# EAGLE design open-lab-VUSB-C (EAGLE 6.5.0)
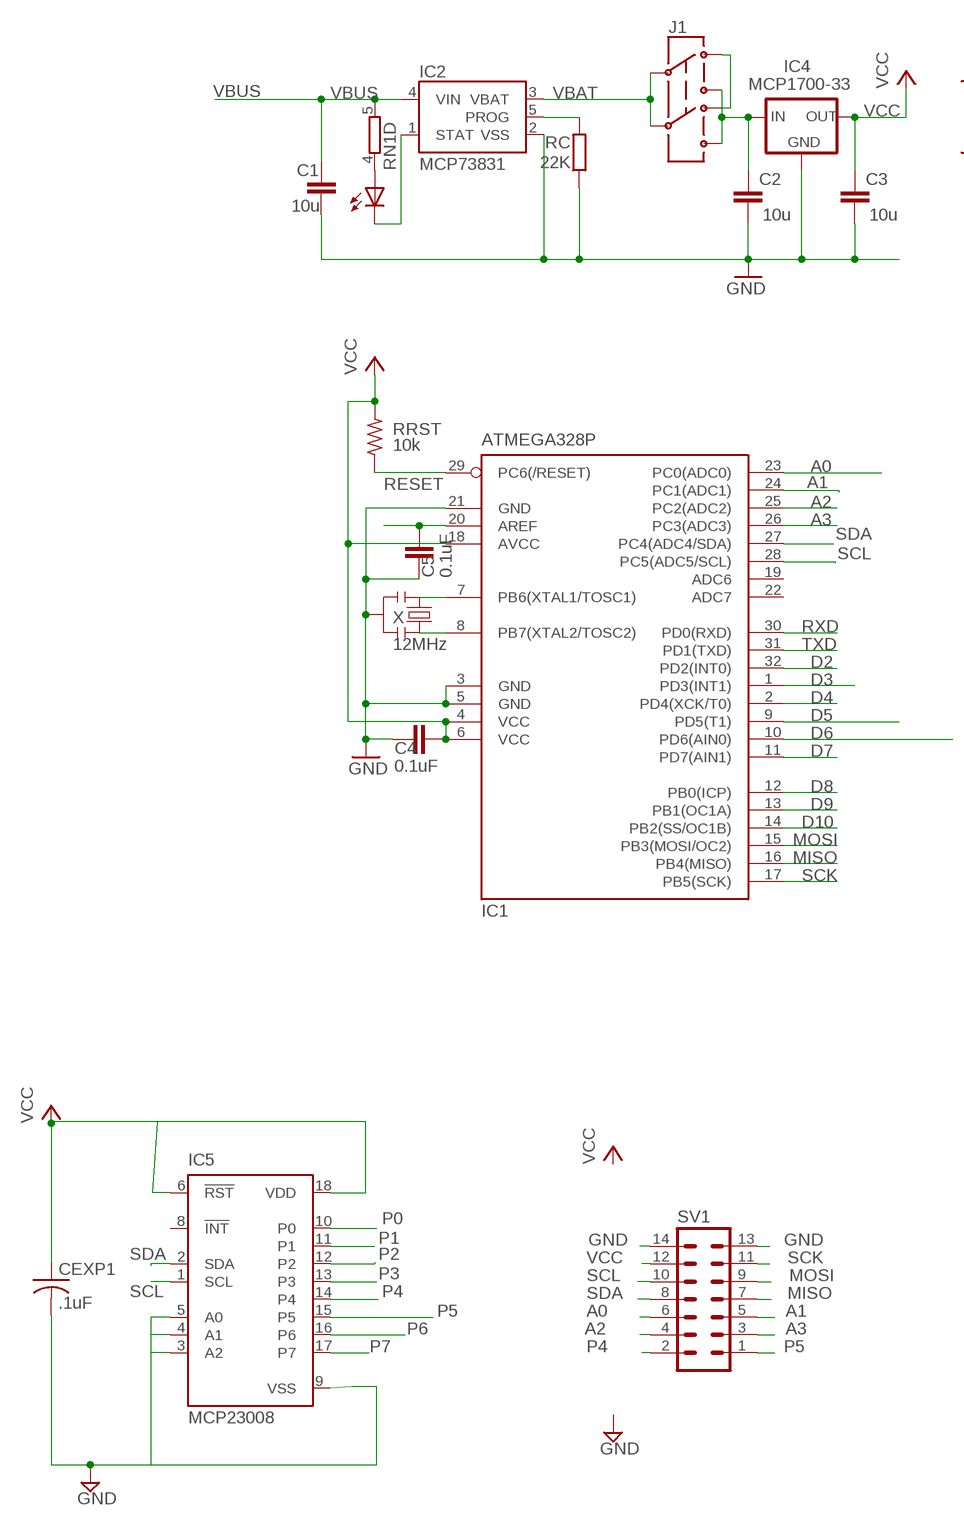
[diagram p0: schematic, sheet 1, part 1 of 2]
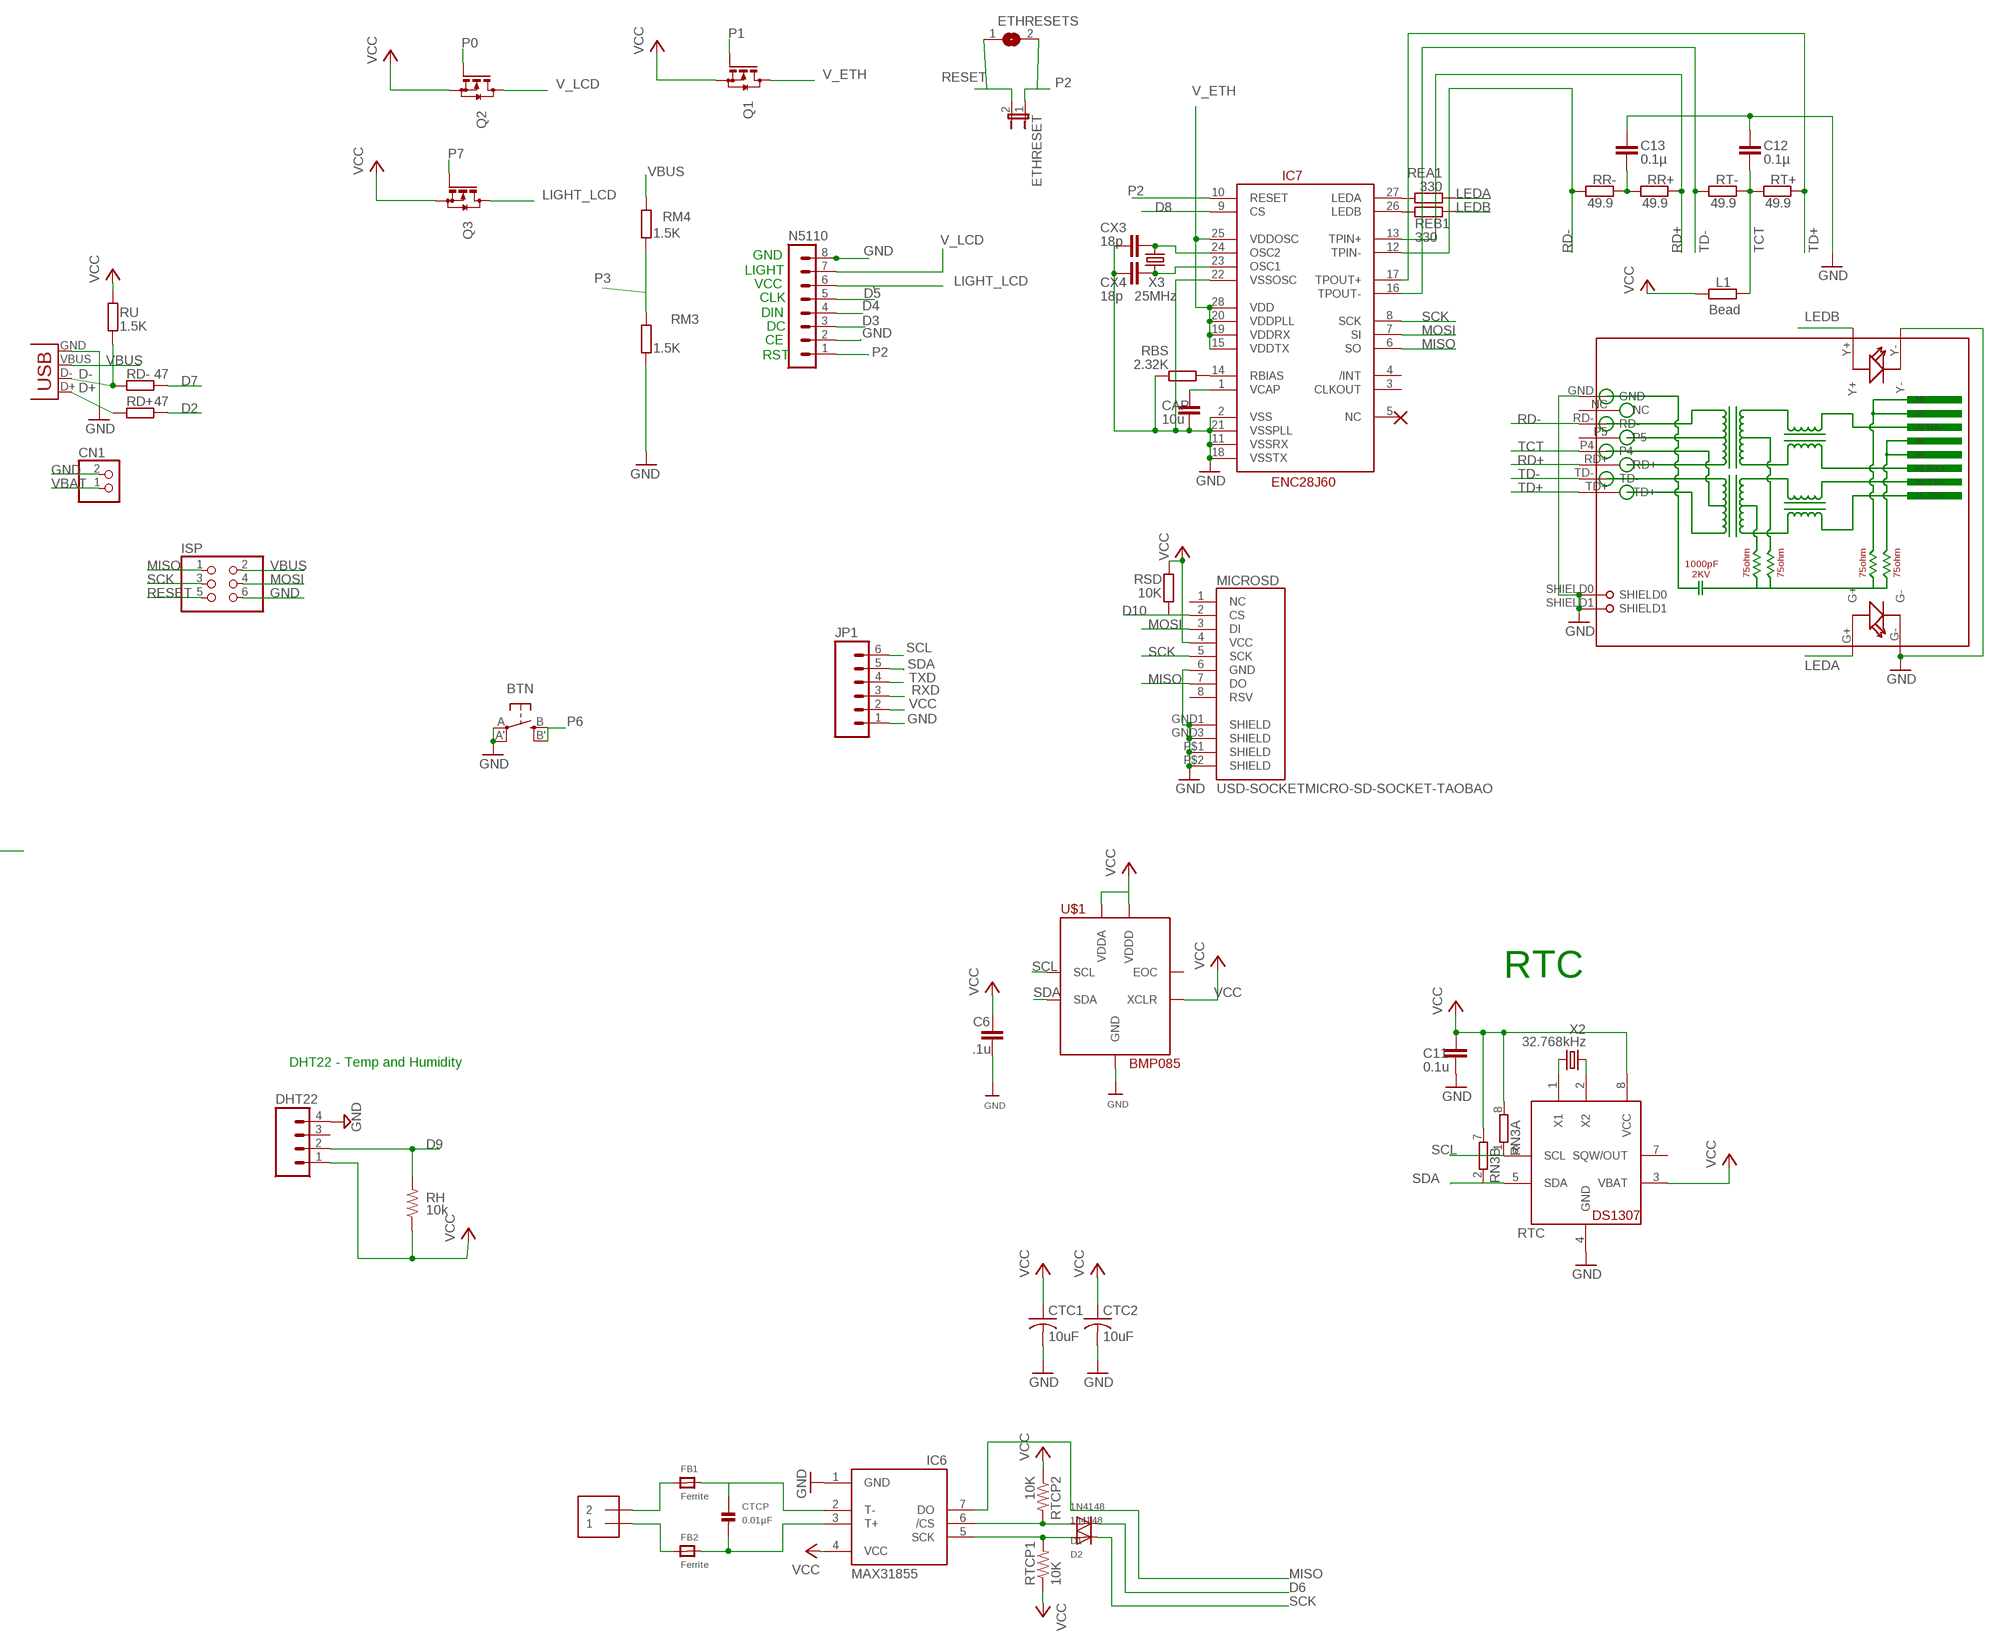
[diagram p1: schematic, sheet 1, part 2 of 2]

## Parts
BTN  EVQQ2  [EVQ-Q2]
C1  10u  C-EUC0805  [C0805]
C2  10u  C-EUC0805  [C0805]
C3  10u  C-EUC0805  [C0805]
C4  0.1uF  C-EUC0805  [C0805]
C5  0.1uF  C-EUC0805  [C0805]
C6  .1u  C-EUC0805  [C0805]
C11  0.1u  C-EUC0805  [C0805]
C12  0.1µ  C-EUC0805  [C0805]
C13  0.1µ  C-EUC0805  [C0805]
CAP  10u  C-EUC0805  [C0805]
CEXP1  .1uF  C-USC0805K  [C0805K]
CHG  0805  LEDCHIPLED_0805  [CHIPLED_0805]
CN1  JST_2PIN-SMT-RA  [JST-PH-2-SMT-RA]
CTC1  10uF  C-USC0805K  [C0805K]
CTC2  10uF  C-USC0805K  [C0805K]
CTCP  0.01µF  CAP_CERAMIC_0805  [_0805]
CX3  18p  C-EUC0805  [C0805]
CX4  18p  C-EUC0805  [C0805]
D1  1N4148  DIODESOD-323F  [SOD-323F]
D2  1n4148  DIODESOD-323F  [SOD-323F]
DHT22  M04LOCK  [1X04_LOCK]
ETHRESET  JP1E  [JP1]
ETHRESETS  SJ  [SJ]
FB1  Ferrite  FERRITE_0805  [_0805]
FB2  Ferrite  FERRITE_0805  [_0805]
IC1  ATMEGA328P  MEGA8-AI  [TQFP32-08]
IC2  MCP73831  [SOT23-5]
IC4  MCP1700-33  MCP1700SOT233  [SOT23]
IC5  MCP23008  MCP23008T  [SO18W]
IC6  MAX31855  MAX6675  [SO08]
IC7  ENC28J60  ENC28J60SO28LONG  [SOIC28WLONG]
ISP  PINHD-2X3  [2X03]
J1  AYZ0202  [AYZ0202]
JP1  M06LOCK  [1X06_LOCK]
L1  Bead  R-EU_R0805  [R0805]
MICROSD  USD-SOCKETMICRO-SD-SOCKET-TAOBAO  [MICRO-SD-SOCKET-TAOBAO]
N5110  MA08-1  [MA08-1]
Q1  BSS123  [SOT23]
Q2  BSS123  [SOT23]
Q3  BSS123  [SOT23]
RBS  2.32K  R-EU_R0805  [R0805]
RC  22K  R-EU_R0805  [R0805]
RD+  47  R-EU_R0805  [R0805]
RD-  47  R-EU_R0805  [R0805]
REA1  330  R-EU_R0805  [R0805]
REB1  330  R-EU_R0805  [R0805]
RH  10k  R-US_R0805  [R0805@1]
RJ45  HR911105A  [HR911105A]
RM3  1.5K  R-EU_R0805  [R0805]
RM4  1.5K  R-EU_R0805  [R0805]
RN1  4R-NEXB38V  [EXB38V]
RN3  4R-NEXB38V  [EXB38V]
RR+  49.9  R-EU_R0805  [R0805]
RR-  49.9  R-EU_R0805  [R0805]
RRST  10k  R-US_R0805  [R0805@1]
RSD  10K  R-EU_R0805  [R0805]
RT+  49.9  R-EU_R0805  [R0805]
RT-  49.9  R-EU_R0805  [R0805]
RTC  DS1307  DS1307SOIC  [SO08]
RTCP1  10K  R-US_R0805  [R0805]
RTCP2  10K  R-US_R0805  [R0805]
RU  1.5K  R-EU_R0805  [R0805]
SV1  MA07-2  [MA07-2]
TCPL  1X2-3.5MM  [1X2-3.5MM]
U$1  BMP085  [BMP085]
X  12MHz  RESONATORSMD  [RESONATOR-SMD]
X1  USBSMD  [USB-MINIB]
X2  32.768kHz  CRYSTALTC26H  [TC26H]
X3  25MHz  CRYSTALHC49UV  [HC49U-V]

## Nets
A0: IC1.23(PC0(ADC0)) SV1.6
A1: IC1.24(PC1(ADC1)) SV1.5
A2: IC1.25(PC2(ADC2)) SV1.4
A3: IC1.26(PC3(ADC3)) SV1.3
AREF: C5.2 IC1.20(AREF)
CS: D1.A IC6.6(/CS) RTCP2.2
D2: IC1.32(PD2(INT0)) RD+.2
D3: IC1.1(PD3(INT1)) N5110.3
D4: IC1.2(PD4(XCK/T0)) N5110.4
D5: IC1.9(PD5(T1)) N5110.5
D6: D1.C IC1.10(PD6(AIN0))
D7: IC1.11(PD7(AIN1)) RD-.2
D8: IC1.12(PB0(ICP)) IC7.9(CS)
D9: DHT22.2 IC1.13(PB1(OC1A)) RH.2
D10: IC1.14(PB2(SS/OC1B)) MICROSD.2(CS) RSD.1
D+: RD+.1 X1.D+
D-: RD-.1 RU.1 X1.D-
GND: BTN.A'(P1) BTN.A(P) C1.2 C2.2 C3.2 C4.1 C5.1 C6.2 C11.2 C12.1 C13.1 CAP.2 CEXP1.2 CN1.2 CTC1.2 CTC2.2 CX3.2 CX4.2 DHT22.4 IC1.3(GND) IC1.5(GND) IC1.21(GND) IC2.2(VSS) IC4.1(GND) IC5.3(A2) IC5.4(A1) IC5.5(A0) IC5.9(VSS) IC6.1(GND) IC7.2(VSS) IC7.11(VSSRX) IC7.18(VSSTX) IC7.21(VSSPLL) IC7.22(VSSOSC) ISP.6 JP1.1 MICROSD.6(GND) MICROSD.GND1(SHIELD) MICROSD.GND3(SHIELD) MICROSD.P$1(SHIELD) MICROSD.P$2(SHIELD) N5110.2 N5110.8 RBS.1 RC.1 RJ45.G- RJ45.GND RJ45.SHIELD0 RJ45.SHIELD1 RJ45.Y- RM3.1 RTC.4(GND) SV1.13 SV1.14 U$1.P$1(GND) X1.GND X.2
LEDA: REA1.2 RJ45.G+
LEDB: REB1.2 RJ45.Y+
LIGHT_LCD: N5110.6 Q3.3(D)
MISO: IC1.16(PB4(MISO)) IC6.7(DO) IC7.6(SO) ISP.1 MICROSD.7(DO) SV1.7
MOSI: IC1.15(PB3(MOSI/OC2)) IC7.7(SI) ISP.4 MICROSD.3(DI) SV1.9
N$1: J1.3 J1.6
N$2: IC1.7(PB6(XTAL1/TOSC1)) X.1
N$3: IC1.8(PB7(XTAL2/TOSC2)) X.3
N$5: CHG.C IC2.1(STAT)
N$6: IC2.5(PROG) RC.2
N$8: FB1.1 TCPL.2
N$9: CTCP.1 FB1.2 IC6.2(T-)
N$10: CHG.A RN1.4
N$11: FB2.1 TCPL.1
N$12: CTCP.2 FB2.2 IC6.3(T+)
N$21: RTC.1(X1) X2.2
N$30: RTC.2(X2) X2.1
N$34: IC7.27(LEDA) REA1.1
N$37: IC7.26(LEDB) REB1.1
N$39: CAP.1 IC7.1(VCAP)
N$41: CX3.1 IC7.24(OSC2) X3.2
N$42: CX4.1 IC7.23(OSC1) X3.1
N$54: C13.2 RR+.2 RR-.1
N$59: IC7.14(RBIAS) RBS.2
P0: IC5.10(P0) Q2.1(G)
P1: IC5.11(P1) Q1.1(G)
P2: ETHRESET.1 ETHRESETS.2 IC5.12(P2) IC7.10(RESET) N5110.1
P3: IC5.13(P3) RM3.2 RM4.1
P4: IC5.14(P4) SV1.2
P5: IC5.15(P5) SV1.1
P6: BTN.B'(S1) BTN.B(S) IC5.16(P6)
P7: IC5.17(P7) Q3.1(G)
RD+: IC7.13(TPIN+) RJ45.RD+ RR+.1
RD-: IC7.12(TPIN-) RJ45.RD- RR-.2
RESET: ETHRESET.2 ETHRESETS.1 IC1.29(PC6(/RESET)) ISP.5 RRST.1
RXD: IC1.30(PD0(RXD)) JP1.3
SCK: D2.C IC1.17(PB5(SCK)) IC7.8(SCK) ISP.3 MICROSD.5(SCK) SV1.11
SCK1: D2.A IC6.5(SCK) RTCP1.2
SCL: IC1.28(PC5(ADC5/SCL)) IC5.1(SCL) JP1.6 RN3.1 RTC.6(SCL) SV1.10 U$1.P$6(SCL)
SDA: IC1.27(PC4(ADC4/SDA)) IC5.2(SDA) JP1.5 RN3.2 RTC.5(SDA) SV1.8 U$1.P$7(SDA)
TCT: C12.2 L1.1 RJ45.P4 RT+.2 RT-.1
TD+: IC7.17(TPOUT+) RJ45.TD+ RT+.1
TD-: IC7.16(TPOUT-) RJ45.TD- RT-.2
TXD: IC1.31(PD1(TXD)) JP1.4
V_ETH: IC7.15(VDDTX) IC7.19(VDDRX) IC7.20(VDDPLL) IC7.25(VDDOSC) IC7.28(VDD) Q1.3(D)
V_LCD: N5110.7 Q2.3(D)
VBAT: CN1.1 IC2.3(VBAT) J1.2 J1.5
VBUS: C1.1 IC2.4(VIN) ISP.2 RM4.2 RN1.5 X1.VBUS
VCC: C3.1 C4.2 C6.1 C11.1 CEXP1.1 CTC1.1 CTC2.1 DHT22.1 IC1.4(VCC) IC1.6(VCC) IC1.18(AVCC) IC4.2(OUT) IC5.6(!RST) IC5.18(VDD) IC6.4(VCC) JP1.2 L1.2 MICROSD.4(VCC) Q1.2(S) Q2.2(S) Q3.2(S) RH.1 RN3.7 RN3.8 RRST.2 RSD.2 RTC.3(VBAT) RTC.8(VCC) RTCP1.1 RTCP2.1 RU.2 SV1.12 U$1.P$3(VDDA) U$1.P$4(VDDD) U$1.P$8(XCLR)
VDD: C2.1 IC4.3(IN) J1.1 J1.4
Unconnected: DHT22.3 IC1.19(ADC6) IC1.22(ADC7) IC5.8(!INT) IC7.3(CLKOUT) IC7.4(/INT) IC7.5(NC) MICROSD.1(NC) MICROSD.8(RSV) RJ45.NC RJ45.P5 RN1.1 RN1.2 RN1.3 RN1.6 RN1.7 RN1.8 RN3.3 RN3.4 RN3.5 RN3.6 RTC.7(SQW/OUT) U$1.P$2(EOC)

## Notes on the sheet
- GND
- LIGHT
- VCC
- CLK
- DIN
- DC
- CE
- RST
- RTC
- DHT22 - Temp and Humidity

## Library data of the parts
BTN = adafruit:EVQQ2: SMT 6mm switch, EVQQ2 series http://www.ladyada.net/library/eagle
C1-C3 C6 C12 C13 CAP CX3 CX4 = resistor:C-EU: CAPACITOR, European symbol
C4 C5 C11 = rcl:C-EU: CAPACITOR, European symbol
CEXP1 CTC1 CTC2 = adafruit:C-US: CAPACITOR, American symbol
CHG = led:LED: LED OSRAM: - CHIPLED LG R971, LG N971, LY N971, LG Q971, LY Q971, LO R971, LY R971 LH N974, LH R974 LS Q976, LO Q976, LY Q976 LO Q996 - Hyper CHIPLED LW Q18S LB Q993, LB Q99A, LB R99A - SideLED LS A670, LO A670, LY A670, LG A670, LP A670 LB A673, LV A673, LT A673, LW A673 LH A674 LY A675 LS A676, LA A676, LO A676, LY A676, LW A676 LS A679, LY A679, LG A679 - Hyper Micro SIDELED® LS Y876, LA Y876, LO Y876, LY Y876 LT Y87S - SmartLED LW L88C, LW L88S LB L89C, LB L89S, LG L890 LS L89K, LO L89K, LY L89K LS L896, LA L896, LO L896, LY L896 - TOPLED LS T670, LO T670, LY T670, LG T670, LP T670 LSG T670, LSP T670, LSY T670, LOP T670, LYG T670 LG T671, LOG T671, LSG T671 LB T673, LV T673, LT T673, LW T673 LH T674 LS T676, LA T676, LO T676, LY T676, LB T676, LH T676, LSB T676, LW T676 LB T67C, LV T67C, LT T67C, LS T67K, LO T67K, LY T67K, LW E67C LS E67B, LA E67B, LO E67B, LY E67B, LB E67C, LV E67C, LT E67C LW T67C LS T679, LY T679, LG T679 LS T770, LO T770, LY T770, LG T770, LP T770 LB T773, LV T773, LT T773, LW T773 LH T774 LS E675, LA E675, LY E675, LS T675 LS T776, LA T776, LO T776, LY T776, LB T776 LHGB T686 LT T68C, LB T68C - Hyper Mini TOPLED® LB M676 - Mini TOPLED Santana® LG M470 LS M47K, LO M47K, LY M47K Source: http://www.osram.convergy.de LUXEON: - LUMILED® LXK2-PW12-R00, LXK2-PW12-S00, LXK2-PW14-U00, LXK2-PW14-V00 LXK2-PM12-R00, LXK2-PM12-S00, LXK2-PM14-U00 LXK2-PE12-Q00, LXK2-PE12-R00, LXK2-PE12-S00, LXK2-PE14-T00, LXK2-PE14-U00 LXK2-PB12-K00, LXK2-PB12-L00, LXK2-PB12-M00, LXK2-PB14-N00, LXK2-PB14-P00, LXK2-PB14-Q00 LXK2-PR12-L00, LXK2-PR12-M00, LXK2-PR14-Q00, LXK2-PR14-R00 LXK2-PD12-Q00, LXK2-PD12-R00, LXK2-PD12-S00 LXK2-PH12-R00, LXK2-PH12-S00 LXK2-PL12-P00, LXK2-PL12-Q00, LXK2-PL12-R00 Source: www.luxeon.com KINGBRIGHT: KA-3528ASYC Source: www.kingbright.com
CN1 = adafruit:JST_2PIN: JST 2-Pin Connectors of various flavors SMT-RA (S2B-PH-SM4) 4UConnector #17311 SMT (B2B-PH-SM4) THM-RA (S2B-PH) THM (B2B-PH)
CTCP = microbuilder:CAP_CERAMIC: Ceramic Capacitors 0402 - 0402 Surface Mount Capacitors 16pF 50V 5% [Digikey: 445-4899-2-ND] 18pF 50V 5% [Digikey: 490-1281-2-ND] 22pF 50V 5% [Digikey: 490-1283-2-ND] 68pF 50V 5% [Digikey: 490-1289-2-ND] 0.1uF 10V 10% [Digikey: 490-1318-2-ND] 1.0uF 6.3V 10% [Digikey: 490-1320-2-ND] 0603 - 0603 Surface Mount Capacitors 16 pF 50V 5% [Digikey: 445-5051-2-ND] 22 pF 50V [Digikey: PCC220ACVTR-ND] 33 pF 50V 5% [Digikey: 490-1415-1-ND] 56pF 50V 5% [Digikey: 490-1421-1-ND] 220pF 50V 5% [Digikey: 445-1285-1-ND] 680 pF 50V 2200 pF 50V 5% C0G [Digikey: 445-1297-1-ND] 5600 pF 100V 5% X7R [Digikey: 478-3711-1-ND] 0.1 µF 25V 10% [Digikey: PCC2277TR-ND] 0.22 µF 16V 10% X7R [Digikey: 445-1318-1-ND] 1.0 µF 25V 10% [Digikey: 445-5146-2-ND] 0603 - RF Specific 3pF 250V +/-0.1pF RF [Digikey: 712-1347-1-ND] 18 pF 250V 5% [Digikey: 478-3505-1-ND or 712-1322-1-ND] 56 pF 250V 5% C0G RF [Digikey: 490-4867-1-ND] 68 pF 250V RF [Digikey: 490-4868-1-ND] 0805 - 0805 Surface Mount Capacitors 220 pF 250V 2% RF Ceramic Capacitor [Digikey: 712-1398-1-ND] 1000 pF 50V 2% NP0 Ceramic Capacitor [Digikey: 478-3760-1-ND] 0.1 µF 25V 10% Ceramic Capacitor [Digikey: PCC1828TR-ND] 1.0 µF 16V 10% Ceramic Capacitor[Digikey: 490-1691-2-ND] 10.0 µF 10V 10% Ceramic Capacitor[Digikey: 709-1228-1-ND] 10.0 uF 16V 10% Ceramic Capacitor [Digikey: 478-5165-2-ND] 47 uF 6.3V 20% Ceramic Capacitor [Digikey: 587-1779-1-ND or 399-5506-1-ND] 1206 - 1206 Surface Mount Capacitors 47uF 10V 20% Ceramic Capacitor [Digikey: 490-5528-1-ND or 399-5508-1-ND or 445-6010-1-ND] 100uF 6.3V -20%, +80% Y5V Ceramic Capacitor (Digikey: 490-4512-1-ND, Mouser: 81-GRM31CF50J107ZE1L)
D1 D2 = adafruit:DIODE: Diode SMADIODE - SMA Surface Mount Package 20V 1A Schottky Diode Digikey: 641-1014-6-ND DO-1N4148 - Through Hole Small Current Diode SOD-123 20V 1 A (.5mV Vf) Schottky Diode - Digikey: MBRX120TPMSCT-ND SOD-323 10V 570mA (.38mV Vf, 3ns) Schottky Diode - Digikey: ZLLS410CT-ND SOD-523 30V 30mA Schottky Diode (RB751S-40TE61) - Digikey: RB751S-40TE61CT-ND SOT23-R/W - SOT23 Package (R = Solder Paste/Reflow Ovens, W = Hand-Soldering) BAT54Film 40V 300mA - Digikey: 497-7162-1-ND
DHT22 = SparkFun-Connectors:M04: Header 4 Standard 4-pin 0.1" header. Use with straight break away headers (SKU : PRT-00116), right angle break away headers (PRT-00553), swiss pins (PRT-00743), machine pins (PRT-00117), and female headers (PRT-00115). Molex polarized connector foot print use with SKU : PRT-08231 with associated crimp pins and housings. 1MM SMD Version SKU: PRT-10208
ETHRESET = jumper:JP1E: JUMPER
ETHRESETS = jumper:SJ: SMD solder JUMPER
FB1 FB2 = microbuilder:FERRITE: Ferrite Bead 0603 MMZ1608B121C - 120 Ohm @ 100MHz, 600mA, 0.15 Ohm DC Resistance - Digikey: 445-2164-1-ND BK1608HW121-T - 120 Ohm, 600mA Ferrite Chip - Digikey: 587-1876-2-ND 0805 HZ0805B272R-10 - 2.7K Ohm @ 100MHz, 200mA, 0.8 Ohm DC Resistance - Digikey: 240-2504-1-ND (see also Murata BLM21BD272SN1L) MMZ2012Y152B - 1.5K Ohm @ 100MHz, 500mA, 0.4 Ohm DC Resistance - Digikey: 445-1560-1-ND - Mainly for high frequency (80-400MHz) MMZ2012R102A - 1K Ohm @ 100MHz, 500mA, 0.3 Ohm DC Resistance - Digikey: 445-1555-2-ND - More general purpose (10-200MHz)
IC1 = atmel:MEGA8: MICROCONTROLLER 8 Kbytes FLASH, 1 kbytes SRAM, 512 bytes EEPROM, USART, 6-channel 10 bit ADC, 2-channel 8 bit ADC Pin compatible with Atmega48, ATMega88, ATMega168 Source: avr.lbr; MPN: ATMEGA8-16AU; OC_FARNELL: 9171371; OC_NEWARK: 73M8863
IC2 = SparkFunNew:MCP73831: Microchip's MCP73831 Miniature single cell, fully integrated Li-Ion, Li-polymer charge management controller http://ww1.microchip.com/downloads/en/DeviceDoc/21984a.pdf
IC4 = adafruit:MCP1700: VOLTAGE REGULATOR
IC5 = JeeLabs:MCP23008: I2C-Bus Remote 8-bit I/O expander http://www.semiconductors.philips.com/acrobat_download/datasheets/PCF8574_4.pdf
IC6 = adafruit:MAX6675
IC7 = SparkFun:ENC28J60
ISP = pinhead:PINHD-2X3: PIN HEADER
J1 = SparkFunNew:AYZ0202: SPDT Slide Switch Simple SMD single-pull double-throw slide switch. Good for less than 350mA power switch, switching UARTs between devices, etc. Spark Fun Electronics SKU : COM-00597
JP1 = SparkFun-Connectors:M06: Header 6 Standard 6-pin 0.1" header. Use with straight break away headers (SKU : PRT-00116), right angle break away headers (PRT-00553), swiss pins (PRT-00743), machine pins (PRT-00117), and female headers (PRT-00115). Molex polarized connector foot print use with SKU : PRT-08094 with associated crimp pins and housings. NOTES ON THE VARIANTS LOCK and LOCK_LONGPADS... This footprint was designed to help hold the alignment of a through-hole component (i.e. 6-pin header) while soldering it into place. You may notice that each hole has been shifted either up or down by 0.005 of an inch from it's more standard position (which is a perfectly straight line). This slight alteration caused the pins (the squares in the middle) to touch the edges of the holes. Because they are alternating, it causes a "brace" to hold the component in place. 0.005 has proven to be the perfect amount of "off-center" position when using our standard breakaway headers. Although looks a little odd when you look at the bare footprint, once you have a header in there, the alteration is very hard to notice. Also,if you push a header all the way into place, it is covered up entirely on the bottom side. This idea of altering the position of holes to aid alignment will be further integrated into the Sparkfun Library for other footprints. It can help hold any component with 3 or more connection pins.
L1 RBS RC RD+ RD- REA1 REB1 RM3 RM4 RR+ RR- RSD RT+ RT- RU = rcl:R-EU_: RESISTOR, European symbol
MICROSD = SparkFunNew:USD-SOCKET: microSD Socket Push-push type uSD socket. Schematic element and footprint production proven. Spark Fun Electronics SKU : PRT-00127. tDoc lines correctly indicate media card edge positions when inserting (unlocked, locked, depressed).
N5110 = con-lstb:MA08-1: PIN HEADER; OC_FARNELL: unknown; OC_NEWARK: unknown
Q1-Q3 = transistor-small-signal:BSS123: N-CHANNEL MOS FET
RH RRST = rcl:R-US_: RESISTOR, American symbol
RJ45 = CONNECTER:HR911105A
RN1 RN3 = resistor-dil:4R-N: Array Chip Resistor Source: RS Component / Phycomp; OC_FARNELL: unknown; OC_NEWARK: unknown
RTC = adafruit:DS1307: DS1307 Real time clock (RTC) with battery backup ability. Talk to it via i2c
RTCP1 RTCP2 = adafruit:R-US_: RESISTOR, American symbol
SV1 = con-lstb:MA07-2: PIN HEADER; OC_FARNELL: unknown; OC_NEWARK: unknown
TCPL = adafruit:1X2: 3.5mm Terminal block http://www.ladyada.net/library/pcb/eaglelibrary.html
U$1 = JeeLabs:BMP085: BMP086 Bosch Digital Pressure Sensor
X = SparkFunNew:RESONATOR: Resonator Small SMD resonator. This is the itty bitty 10/20MHz resonators with built in caps. CSTCE10M0G55 and CSTCE20M0V53. Footprint has been reviewed closely but hasn't been tested yet.
X1 = SparkFun:USB: USB Connectors USB-B-PTH is fully proven SKU : PRT-00139 USB-miniB is fully proven SKU : PRT-00587 USB-A-PCB is untested. USB-A-H is throughly reviewed, but untested. Spark Fun Electronics SKU : PRT-00437 USB-B-SMT is throughly reviewed, but untested. Needs silkscreen touching up. USB-A-S has not been used/tested USB-MB-H has not been used/tested
X2 = crystal:CRYSTAL: CRYSTAL; OC_FARNELL: unknown; OC_NEWARK: unknown
X3 = SparkFun:CRYSTAL: Crystals Various standard crystals. Proven footprints. Spark Fun Electronics SKU : COM-00534

## Net classes
0 default: width 0.203 mm
1 power: width 0.381 mm

## Board
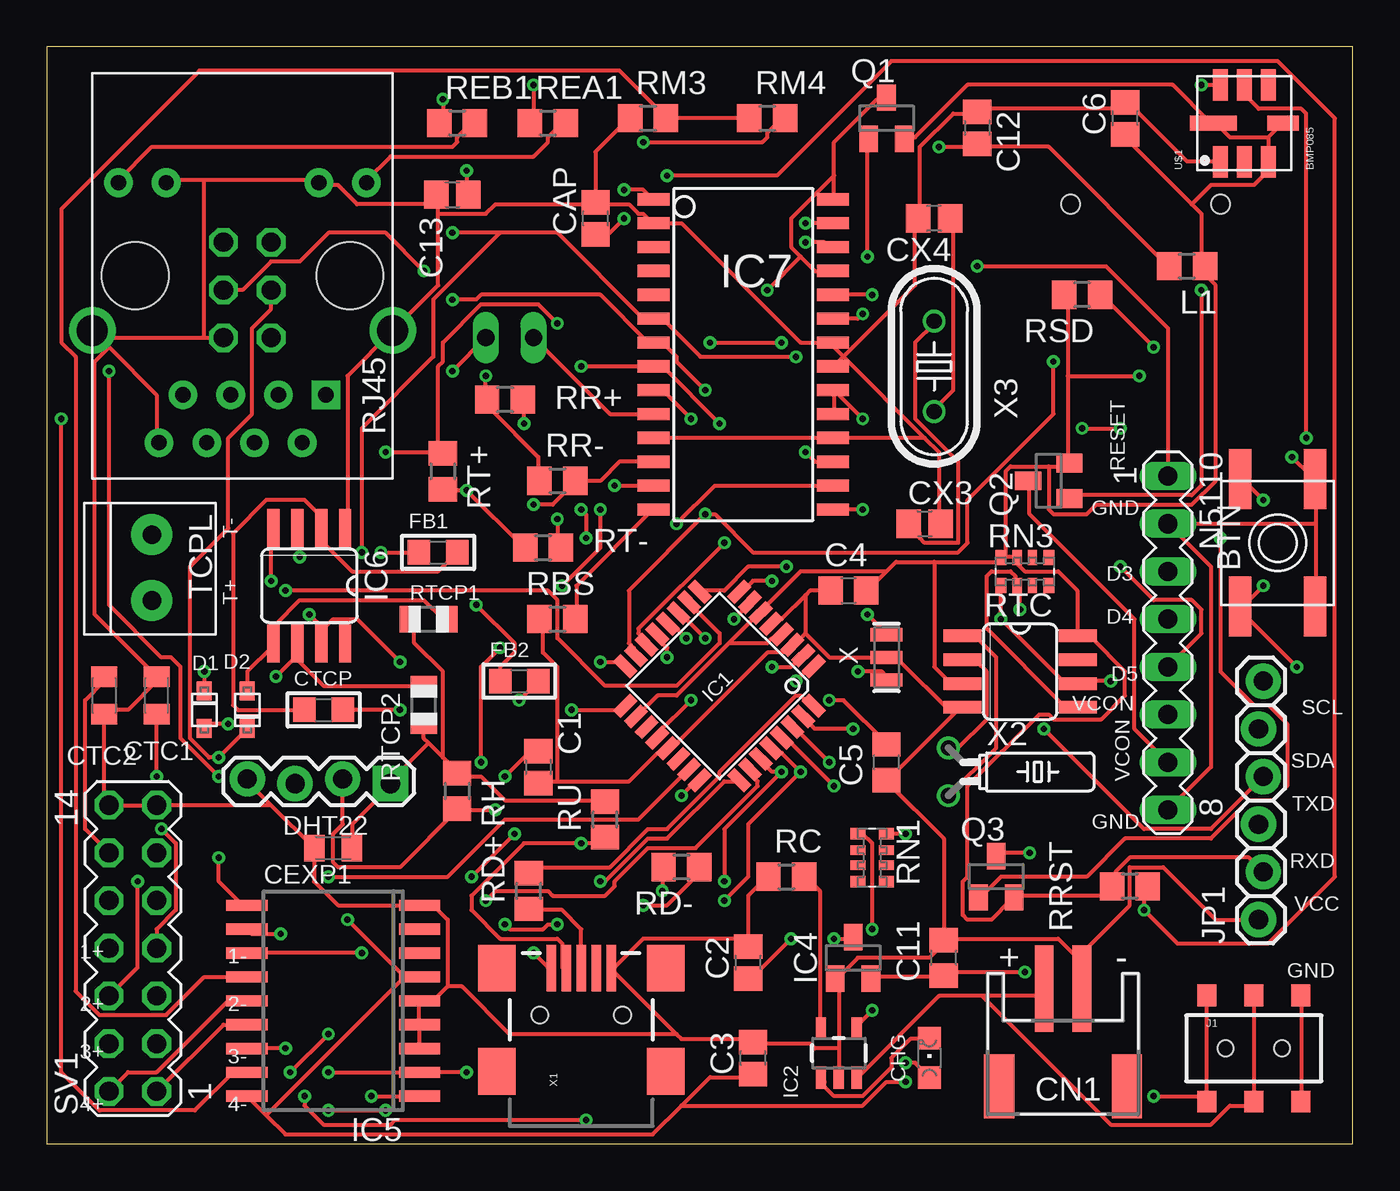
[diagram p2: board, top side]
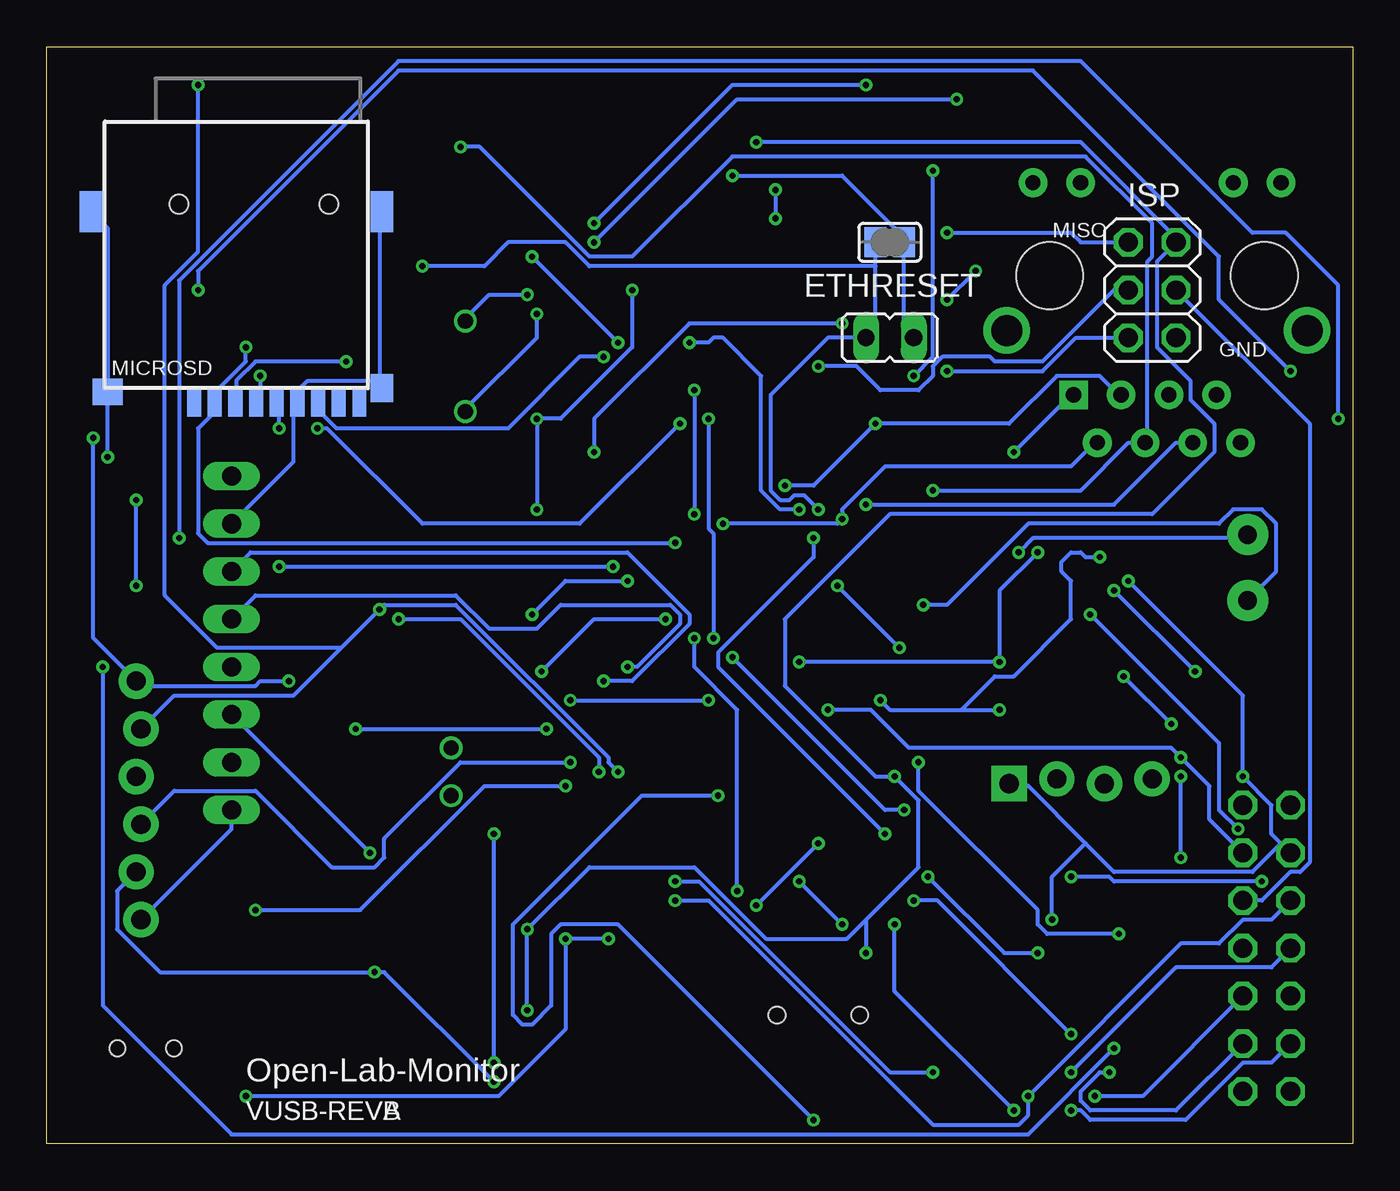
[diagram p3: board, bottom side, seen from below]

Size 69.52 x 58.41 mm. Coordinates in mm from the lower left corner, seen from the top.
Outline: 0,0 69.52,0 69.52,58.41 0,58.41 0,0
Copper layers (1*16): Top 0.0356mm / dielectric 1.5011mm / Bottom 0.0356mm
Design rules "LaenPCBOrder": minimum track width 6mil, minimum drill 13mil, track to track 6mil, track to pad 6mil, pad to pad 6mil, via to via 6mil, smd to smd 6mil, copper to edge 15mil, drill to drill 6mil, minimum pad ring 7mil, minimum via ring 7mil, stop-mask expansion 3mil, vias tented up to drill 0mil, thermal gap 10mil

### Footprints (pad centres in the part's own frame; a part is rotated, then mirrored left to right if it is on the bottom)
EVQ-Q2 = smd 3.2 x 1.2: A -3.4,-2; A' 3.4,-2; B -3.4,2; B' 3.4,2
C0805 = smd 1.3 x 1.5: 1 -0.85,0; 2 0.85,0
C0805' = smd 1.3 x 1.5: 1 -0.95,0; 2 0.95,0
C0805K = smd 1.1 x 1.4: 1 -1,0; 2 1,0
CHIPLED_0805 = smd 1.2 x 1.2: A 0,-1.05; C 0,1.05
JST-PH-2-SMT-RA = smd 1 x 4.6: 1 1,-3.7; 2 -1,-3.7 | smd 1.6 x 3.4: NC1 -3.4,1.5; NC2 3.4,1.5
_0805 = smd 1.2 x 1.3: 1 -1.016,0; 2 1.016,0
SOD-323F = smd 1 x 0.8: A -1,0; C 1,0
1X04_LOCK = drill 1.016 pad 1.88 square: 1 0,0.127 | drill 1.016 pad 1.88: 2 2.54,-0.127; 3 5.08,0.127; 4 7.62,-0.127
JP1 = drill 0.914 long: 1 0,-1.27; 2 0,1.27
SJ = smd 1.168 x 1.6: 1 -0.762,0; 2 0.762,0
TQFP32-08 = smd 1.27 x 0.559: 1 -4.293,2.8; 2 -4.293,2; 3 -4.293,1.2; 4 -4.293,0.4; 5 -4.293,-0.4; 6 -4.293,-1.2; 7 -4.293,-2; 8 -4.293,-2.8; 17 4.293,-2.8; 18 4.293,-2; 19 4.293,-1.2; 20 4.293,-0.4; 21 4.293,0.4; 22 4.293,1.2; 23 4.293,2; 24 4.293,2.8 | smd 0.559 x 1.27: 9 -2.8,-4.293; 10 -2,-4.293; 11 -1.2,-4.293; 12 -0.4,-4.293; 13 0.4,-4.293; 14 1.2,-4.293; 15 2,-4.293; 16 2.8,-4.293; 25 2.8,4.293; 26 2,4.293; 27 1.2,4.293; 28 0.4,4.293; 29 -0.4,4.293; 30 -1.2,4.293; 31 -2,4.293; 32 -2.8,4.293
SOT23-5 = smd 0.55 x 1.2: 1 -0.95,-1.3; 2 0,-1.3; 3 0.95,-1.3; 4 0.95,1.3; 5 -0.95,1.3
SOT23 = smd 1 x 1.4: 1 -0.95,-1.1; 2 0.95,-1.1; 3 0,1.1
SO18W = smd 0.6 x 2.2: 1 -5.08,-4.6; 2 -3.81,-4.6; 3 -2.54,-4.6; 4 -1.27,-4.6; 5 0,-4.6; 6 1.27,-4.6; 7 2.54,-4.6; 8 3.81,-4.6; 9 5.08,-4.6; 10 5.08,4.6; 11 3.81,4.6; 12 2.54,4.6; 13 1.27,4.6; 14 0,4.6; 15 -1.27,4.6; 16 -2.54,4.6; 17 -3.81,4.6; 18 -5.08,4.6
SO08 = smd 0.66 x 2.032: 1 -1.905,-3.073; 2 -0.635,-3.073; 3 0.635,-3.073; 4 1.905,-3.073; 5 1.905,3.073; 6 0.635,3.073; 7 -0.635,3.073; 8 -1.905,3.073
SOIC28WLONG = smd 0.65 x 1.7: 1 -8.89,-4.78; 2 -7.62,-4.78; 3 -6.35,-4.78; 4 -5.08,-4.78; 5 -3.81,-4.78; 6 -2.54,-4.78; 7 -1.27,-4.78; 8 0,-4.78; 9 1.27,-4.78; 10 2.54,-4.78; 11 3.81,-4.78; 12 5.08,-4.78; 13 6.35,-4.78; 14 7.62,-4.78; 15 7.62,4.78; 16 6.35,4.78; 17 5.08,4.78; 18 3.81,4.78; 19 2.54,4.78; 20 1.27,4.78; 21 0,4.78; 22 -1.27,4.78; 23 -2.54,4.78; 24 -3.81,4.78; 25 -5.08,4.78; 26 -6.35,4.78; 27 -7.62,4.78; 28 -8.89,4.78
2X03 = drill 1.016 octagon: 1 -2.54,-1.27; 2 -2.54,1.27; 3 0,-1.27; 4 0,1.27; 5 2.54,-1.27; 6 2.54,1.27
AYZ0202 = smd 1 x 1.15: 1 -2.5,2.825; 2 0,2.825; 3 2.5,2.825; 4 -2.5,-2.825; 5 0,-2.825; 6 2.5,-2.825 | hole 0.85: 1.5,0; -1.5,0
1X06_LOCK = drill 1.016 pad 1.88: 1 0,0; 2 2.54,-0.254; 3 5.08,0; 4 7.62,-0.254; 5 10.16,0; 6 12.7,-0.254
R0805 = smd 1.3 x 1.5: 1 -0.95,0; 2 0.95,0
MICRO-SD-SOCKET-TAOBAO = smd 0.75 x 1.6: 1 2.25,10.5; 2 1.15,10.5; 3 0.05,10.5; 4 -1.05,10.5; 5 -2.15,10.5; 6 -3.25,10.5; 7 -4.35,10.5; 8 -5.45,10.5 | smd 0.7 x 1.6: CD -6.55,10.5 | smd 1.2 x 1.5: GND1 -7.75,9.8 | smd 1.6 x 1.4: GND3 6.85,10 | smd 1.2 x 2.2: P$1 7.75,0.4; P$2 -7.75,0.4 | hole 1: 3.05,0; -4.93,0
MA08-1 = drill 1.016 long: 1 -8.89,0; 2 -6.35,0; 3 -3.81,0; 4 -1.27,0; 5 1.27,0; 6 3.81,0; 7 6.35,0; 8 8.89,0
R0805@1 = smd 1.3 x 1.5: 1 -0.95,0; 2 0.95,0
HR911105A = drill 0.813 pad 1.524: G+ 4.953,-6.604; G- 4.953,-4.064; GND -8.89,4.445; NC -6.35,3.175; P4 -8.89,-0.635; P5 -6.35,0.635; RD+ -6.35,-1.905; RD- -8.89,1.905; TD- -8.89,-3.175; Y+ 4.953,6.604; Y- 4.953,4.064 | drill 1.651 pad 2.159: SHIELD0 -2.921,8.001; SHIELD1 -2.921,-8.001 | drill 0.813 pad 1.524 square: TD+ -6.35,-4.445 | hole 3.556: 0,-5.715; 0,5.715
EXB38V = smd 0.6 x 0.8: 1 -1.275,-0.75; 4 1.275,-0.75; 5 1.275,0.75; 8 -1.275,0.75 | smd 0.5 x 0.8: 2 -0.4,-0.75; 3 0.4,-0.75; 6 0.4,0.75; 7 -0.4,0.75
R0805' = smd 1.1 x 1.4: 1 -1,0; 2 1,0
MA07-2 = drill 1.016 octagon: 1 -7.62,-1.27; 2 -7.62,1.27; 3 -5.08,-1.27; 4 -5.08,1.27; 5 -2.54,-1.27; 6 -2.54,1.27; 7 0,-1.27; 8 0,1.27; 9 2.54,-1.27; 10 2.54,1.27; 11 5.08,-1.27; 12 5.08,1.27; 13 7.62,-1.27; 14 7.62,1.27
1X2-3.5MM = drill 1 pad 2.184: 1 1.8,0; 2 -1.7,0
BMP085 = smd 1.68 x 0.8: P$1 -2.06,1.27; P$2 -2.06,0; P$3 -2.06,-1.27; P$5 2.04,-1.27; P$6 2.04,0; P$7 2.04,1.27 | smd 0.8 x 1.68: P$4 0,-2.06 | smd 0.8 x 2.5: P$8 0,1.65
RESONATOR-SMD = smd 0.7 x 1.7: 1 -1.2,0; 2 0,0; 3 1.2,0
USB-MINIB = smd 2.5 x 0.5: D+ 2.5,0; D- 2.5,0.8; GND 2.5,-1.6; ID 2.5,-0.8; VBUS 2.5,1.6 | smd 2.5 x 2: GND@1 -3,-4.5; GND@2 -3,4.5; GND@3 2.5,4.5; GND@4 2.5,-4.5 | hole 0.9: 0,2.2; 0,-2.2
TC26H = drill 0.813: 1 -1.27,0; 2 1.27,0
HC49U-V = drill 0.813: 1 -2.413,0; 2 2.413,0

### Placement (x,y rotation side)
BTN  65.53,32 90 top
C1  26.16,20.07 270 top
C2  37.34,9.65 90 top
C3  37.59,4.57 90 top
C4  0.1uF  [C0805']  42.67,29.46 0 top
C5  0.1uF  [C0805']  44.7,20.32 90 top
C6  57.4,54.61 90 top
C11  0.1u  [C0805']  47.75,9.91 90 top
C12  49.53,54.1 270 top
C13  21.59,50.55 0 top
CAP  29.21,49.28 90 top
CEXP1  15.24,15.75 180 top
CHG  46.99,4.57 0 top
CN1  54.1,4.57 180 top
CTC1  5.84,23.88 90 top
CTC2  3.05,23.88 270 top
CTCP  14.73,23.11 0 top
CX3  46.74,33.02 0 top
CX4  47.24,49.28 180 top
D1  8.38,23.11 90 top
D2  10.67,23.11 270 top
DHT22  18.29,19.3 180 top
ETHRESET  24.64,42.93 270 bottom
ETHRESETS  24.64,48.01 180 bottom
FB1  20.83,31.5 0 top
FB2  25.15,24.64 0 top
IC1  35.81,24.38 225 top
IC2  42.16,4.83 0 top
IC4  42.93,9.91 0 top
IC5  15.24,7.62 90 top
IC6  13.97,29.72 180 top
IC7  37.08,41.4 270 top
ISP  10.67,45.47 270 bottom
J1  64.26,5.08 0 top
JP1  64.52,11.94 90 top
L1  60.71,46.74 0 top
MICROSD  59.44,50.04 180 bottom
N5110  59.69,26.67 270 top
Q1  44.7,54.61 0 top
Q2  53.34,35.31 90 top
Q3  50.55,14.22 0 top
RBS  27.18,27.94 0 top
RC  39.37,14.22 0 top
RD+  25.65,13.46 90 top
RD-  33.78,14.73 180 top
REA1  26.67,54.36 0 top
REB1  21.84,54.36 0 top
RH  21.84,18.8 270 top
RJ45  10.41,46.23 90 top
RM3  32,54.61 0 top
RM4  38.35,54.61 0 top
RN1  43.94,15.24 90 top
RN3  52.07,30.48 0 top
RR+  24.38,39.62 180 top
RR-  27.18,35.31 0 top
RRST  57.66,13.72 180 top
RSD  55.12,45.21 180 top
RT+  21.08,35.81 270 top
RT-  26.42,31.75 0 top
RTC  51.82,25.15 270 top
RTCP1  10K  [R0805']  20.32,27.94 0 top
RTCP2  10K  [R0805']  20.07,23.37 90 top
RU  29.72,17.27 90 top
SV1  4.57,10.41 90 top
TCPL  5.59,30.73 270 top
U$1  63.75,54.36 90 top
X  44.7,25.91 90 top
X1  28.45,6.86 90 top
X2  48.01,19.81 270 top
X3  47.24,41.4 90 top

### Tracks (layer width: path | path; a pad name or v marks a point on that pad's centre or on a via)
A0  (via drill 0.33)
  Top 0.203: v14.99,14.22 21.34,14.22 24.38,17.27 31.5,17.27 34.04,19.81 IC1.23 | v4.83,13.97 4.83,9.4 SV1.6
  Bottom 0.203: v14.99,14.22 12.95,14.22 12.7,13.97 v4.83,13.97
A1  (via drill 0.33)
  Top 0.203: v33.78,18.54 34.54,19.3 IC1.24 | v28.7,1.27 18.54,1.27 18.29,1.02 14.73,1.02 13.72,2.03 v13.72,2.54
  Bottom 0.203: v33.78,18.54 37.85,18.54 44.7,11.68 44.7,6.86 44.2,6.35 43.69,6.35 42.67,7.37 42.67,11.18 42.16,11.68 39.12,11.68 v28.7,1.27 | v13.72,2.54 11.18,2.54 SV1.5
A2  (via drill 0.33)
  Top 0.203: v29.46,13.97 29.72,13.97 32,16.26 33.02,16.26 36.07,19.3 36.83,19.3 IC1.25 | v27.18,11.68 26.67,11.68 26.42,11.43 24.64,11.43 v24.38,11.68 | v14.99,1.78 v18.03,1.78
  Bottom 0.203: v27.18,11.68 v29.46,13.97 | v24.38,11.68 24.38,8.13 v18.03,1.78 | v14.99,1.78 14.48,1.78 13.97,1.27 8.89,1.27 5.84,4.32 4.32,4.32 SV1.4
A3  (via drill 0.33)
  Top 0.203: v23.37,12.95 23.88,13.46 26.67,13.46 26.92,13.21 29.72,13.21 30.23,13.72 30.23,13.97 32,15.75 34.54,15.75 37.85,19.05 37.85,19.3 37.59,19.56 37.59,19.81 IC1.26 | v12.95,3.81 v14.99,5.84
  Bottom 0.203: v23.37,12.95 22.1,12.95 v14.99,5.84 | v12.95,3.81 13.46,3.81 14.48,2.79 14.48,2.29 13.97,1.78 9.4,1.78 SV1.3
AREF  (via drill 0.33)
  Top 0.203: v34.29,23.62 32.51,21.84 IC1.20 | v41.66,23.62 42.42,23.62 44.7,21.34 C5.2
  Bottom 0.203: v41.66,23.62 v34.29,23.62
CS  (via drill 0.33)
  Top 0.203: v9.65,22.35 8.38,22.35 D1.A | 13.21,25.91 v12.19,24.89 | 13.21,25.91 13.21,26.42 IC6.6 13.21,25.91 | 13.21,25.91 14.73,24.38 20.07,24.38 RTCP2.2
  Bottom 0.203: v12.19,24.89 v9.65,22.35
D2
  Top 0.203: IC1.32 40.64,23.37 40.13,23.88 39.88,23.88 35.81,19.81 35.81,19.56 33.02,16.76 32,16.76 29.97,14.73 25.91,14.73 25.65,14.48 RD+.2
D3  (via drill 0.33)
  Top 0.203: v39.88,24.64 40.64,25.4 IC1.1
  Bottom 0.203: v39.88,24.64 38.35,24.64 35.31,27.69 35.31,28.19 38.61,31.5 58.67,31.5 N5110.3
D4  (via drill 0.33)
  Top 0.203: v38.61,25.4 39.62,25.4 40.13,25.91 IC1.2
  Bottom 0.203: v38.61,25.4 38.1,25.4 35.81,27.69 35.81,28.19 36.32,28.7 42.16,28.7 43.43,27.43 45.97,27.43 47.75,29.21 58.42,29.21 N5110.4
D5  (via drill 0.33)
  Top 0.203: v39.37,30.73 37.34,30.73 36.07,29.46 34.8,29.46 IC1.9 | v57.15,30.73 58.93,28.96 60.96,28.96 61.47,28.45 61.47,27.18 N5110.5
  Bottom 0.203: v57.15,30.73 v39.37,30.73
D6  (via drill 0.33)
  Top 0.203: v8.38,25.15 D1.C | v12.7,29.46 26.67,29.46 27.18,28.96 27.18,26.92 29.72,24.38 33.53,24.38 35.81,26.67 35.81,27.18 34.29,28.7 IC1.10
  Bottom 0.203: v12.7,29.46 v8.38,25.15
D7  (via drill 0.33)
  Top 0.203: v35.05,26.92 33.78,28.19 IC1.11 | v32.77,13.46 32.77,14.73 RD-.2
  Bottom 0.203: v35.05,26.92 35.05,25.4 32.77,23.11 v32.77,13.46
D8  (via drill 0.33)
  Top 0.203: v34.04,26.92 33.27,27.69 IC1.12 | v34.29,38.61 32.77,40.13 IC7.9
  Bottom 0.203: v34.04,26.92 34.04,32.51 34.29,32.77 v34.29,38.61
D9  (via drill 0.33)
  Top 0.203: v33.02,25.91 33.02,26.42 32.51,26.92 IC1.13 | 21.84,17.78 v23.88,17.78 | DHT22.2 15.75,17.02 15.24,16.51 15.24,14.99 15.49,14.73 18.8,14.73 21.84,17.78 | 21.84,17.78 RH.2
  Bottom 0.203: v33.02,25.91 24.89,17.78 v23.88,17.78
D10  (via drill 0.33)
  Top 0.203: v36.07,32 31.5,27.43 31.5,27.18 31.75,26.92 31.75,26.67 IC1.14 | v58.93,42.42 56.13,45.21 RSD.1
  Bottom 0.203: v36.07,32 60.96,32 61.47,32.51 61.47,38.1 60.71,38.86 60.71,39.37 MICROSD.2 60.45,39.62 60.45,40.13 58.93,41.66 v58.93,42.42
D+
  Top 0.203: X1.D+ 28.45,11.43 27.43,12.45 25.65,12.45 RD+.1
D-  (via drill 0.33)
  Top 0.203: v31.75,12.7 33.02,12.7 34.54,14.22 34.54,14.73 RD-.1 | RU.1 29.72,16.26 29.46,16 v28.45,16 25.4,16 22.61,13.21 22.61,12.45 24.13,10.92 27.18,10.92 27.43,10.67 27.43,9.4 X1.D-
  Bottom 0.203: v28.45,16 v31.75,12.7
GND  (via drill 0.33)
  Top 0.203: U$1.P$1 62.48,52.32 60.71,52.32 57.4,55.63 C6.2 57.4,55.37 57.15,55.12 49.53,55.12 C12.1 49.53,54.86 48.26,54.86 46.48,53.09 46.48,49.28 CX4.2 46.23,49.28 46.23,45.72 42.42,41.91 | IC7.11 IC7.18 46.74,37.59 | 41.66,42.67 42.42,41.91 | 42.42,41.91 46.74,37.59 | 46.74,37.59 47.5,36.83 47.5,33.02 CX3.2 | 42.42,41.91 41.91,41.4 IC7.21 | 8.38,51.31 14.48,51.31 RJ45.G- 14.48,51.05 15.49,51.05 16.51,50.04 20.83,50.04 | 8.38,51.31 6.35,51.31 RJ45.Y- | 2.79,42.93 RJ45.SHIELD0 2.54,43.18 | 2.79,42.93 3.3,42.42 | 3.3,42.42 5.84,39.88 5.84,37.34 RJ45.GND | 2.79,42.93 8.38,42.93 | 8.38,42.93 ISP.6 | 8.38,42.93 8.38,51.31 | RM3.1 30.99,54.61 29.21,52.83 CAP.2 29.21,50.04 | 29.21,50.04 30.99,50.04 31.5,49.53 31.75,49.53 32.26,49.02 IC7.2 33.78,49.02 40.13,42.67 41.66,42.67 | 20.83,49.53 20.83,45.72 RJ45.SHIELD1 16,40.89 16,33.02 IC6.1 | 20.83,49.53 20.83,50.04 | 20.83,50.04 20.83,50.55 C13.1 20.83,50.04 | 29.21,50.04 23.88,50.04 23.37,49.53 20.83,49.53 | 41.66,42.67 IC7.22 | 67.56,33.02 67.56,35.31 BTN.A' 67.31,35.56 v66.29,36.58 | 67.56,33.02 67.56,28.7 BTN.A | N5110.8 61.98,20.07 61.98,30.73 N5110.2 67.56,33.02 | 19.81,6.35 19.81,5.08 IC5.3 | 19.81,6.35 19.81,7.62 IC5.5 20.57,7.62 21.34,8.38 | 19.81,6.35 IC5.4 | 11.94,18.03 10.67,19.3 DHT22.4 | 11.94,18.03 14.22,15.75 | 14.22,15.75 14.22,13.97 15.49,12.7 IC5.9 20.57,12.7 21.34,11.94 21.34,8.38 | 14.22,15.75 CEXP1.2 | 11.94,18.03 SV1.13 SV1.14 3.05,18.29 CTC2.2 3.05,23.11 4.32,23.11 5.84,24.64 CTC1.2 5.84,24.89 2.54,28.19 2.54,41.66 3.3,42.42 | 42.16,5.08 42.16,8.64 IC4.1 42.16,8.89 43.18,9.91 46.99,9.91 47.75,10.67 C11.2 47.75,10.92 | 42.16,5.08 IC2.2
  Top 0.203: 42.16,5.08 40.89,5.08 40.64,5.33 37.59,5.33 C3.2 37.59,5.59 33.78,5.59 33.53,5.84 | 37.34,10.92 37.34,13.21 38.35,14.22 RC.1 | 37.34,10.92 C2.2 37.34,10.67 | 37.34,10.92 31.75,10.92 30.23,9.4 X1.GND 30.23,9.14 33.53,5.84 | 27.18,19.3 26.16,19.3 C1.2 | 27.18,19.3 30.99,19.3 32.51,20.83 33.02,20.83 IC1.21 33.27,21.08 38.35,26.16 39.37,26.16 39.62,26.42 IC1.3 39.88,26.67 40.39,27.18 | 27.18,19.3 27.18,25.4 26.42,26.16 26.42,27.94 RBS.1 | 40.39,29.21 40.64,29.46 C4.1 | 40.39,29.21 39.12,27.94 38.61,27.94 IC1.5 | 40.39,29.21 40.39,27.18 | 40.39,27.18 41.66,25.91 X.2 45.21,25.91 48.26,22.86 | 48.77,23.37 RTC.4 48.51,23.11 48.26,22.86 | 47.75,10.92 47.75,16.26 44.7,19.3 | 44.7,19.3 48.26,22.86 | 44.7,19.3 C5.1 | 54.86,9.91 54.86,8.38 CN1.2 54.86,9.91 | 54.86,9.91 53.85,10.92 47.75,10.92 | 21.34,8.38 22.1,8.38 24.64,5.84 33.53,5.84 | JP1.1 62.23,11.94 59.44,14.73 57.66,14.73 57.66,12.7 54.86,9.91
  Bottom 0.203: MICROSD.P$1 67.06,49.53 66.29,48.77 66.29,40.13 MICROSD.GND3 66.29,39.88 v66.29,36.58 | N5110.8 59.69,16.76 JP1.1 | 51.82,40.64 51.82,49.53 MICROSD.P$2 | 51.82,40.64 51.82,40.39 MICROSD.GND1 51.82,40.64 | N5110.2 56.39,36.32 56.39,39.37 MICROSD.6 56.13,39.62 56.13,40.13 55.63,40.64 51.82,40.64
LEDA
  Top 0.203: REA1.2 27.43,54.36 26.67,53.59 26.67,53.34 25.91,52.58 18.29,52.58 17.02,51.31 RJ45.G+
LEDB
  Top 0.203: REB1.2 22.61,54.36 21.84,53.59 21.84,53.34 21.59,53.09 5.59,53.09 3.81,51.31 RJ45.Y+
LIGHT_LCD  (via drill 0.33)
  Top 0.203: v52.32,15.49 50.55,15.49 Q3.3
  Bottom 0.203: N5110.6 v52.32,15.49
MISO  (via drill 0.33)
  Top 0.203: v29.46,25.65 30.73,25.65 IC1.16 | v18.8,25.65 16.51,27.94 15.24,27.94 14.73,27.43 | 14.73,27.43 14.73,26.67 IC6.7 14.73,27.43 | SV1.7 5.84,11.43 6.86,12.45 6.86,16 v6.1,16.76 | 14.73,27.43 v13.97,28.19 | v39.88,41.91 34.8,41.91 32.77,43.94 IC7.6 31.75,43.94 27.18,48.51 24.13,48.51 | 24.13,48.51 v21.59,48.51 | v16.76,31.5 16.76,38.1 20.57,41.91 20.57,44.96 24.13,48.51
  Bottom 0.203: v29.46,25.65 v18.8,25.65 18.8,29.46 v16.76,31.5 | v6.1,16.76 7.11,17.78 7.11,21.34 v13.97,28.19 | v39.88,41.91 41.15,41.91 44.96,38.1 54.1,38.1 54.86,38.86 54.86,39.37 MICROSD.7 | ISP.1 14.48,48.01 14.99,48.51 v21.59,48.51
MOSI  (via drill 0.33)
  Top 0.203: v35.05,40.13 33.53,41.66 33.53,41.91 32.77,42.67 IC7.7 32,42.67 29.46,45.21 23.11,45.21 22.86,44.96 v21.59,44.96 | IC1.15 31.24,26.16 31.24,26.42 30.99,26.67 30.99,29.46 v35.05,33.53 35.56,33.53 37.59,31.5 48.51,31.5 49.02,32 49.02,34.29 53.59,38.86 v53.59,41.66 | ISP.4 10.41,45.47 11.94,46.99 13.46,46.99 14.99,48.51 18.03,48.51 v20.07,46.48
  Bottom 0.203: SV1.9 4.83,12.95 3.3,14.48 2.79,14.48 2.29,14.99 2.29,38.35 ISP.4 | v35.05,40.13 v35.05,33.53 | v53.59,41.66 58.42,41.66 59.44,40.64 59.44,39.62 MICROSD.3 | v21.59,44.96 v20.07,46.48
N$1
  Top 0.203: J1.6 66.8,2.29 66.8,7.87 J1.3
N$2  (via drill 0.33)
  Top 0.203: v36.58,27.94 37.34,28.7 IC1.7 | v43.18,25.15 44.45,25.15 44.7,24.89 X.1
  Bottom 0.203: v36.58,27.94 40.39,27.94 v43.18,25.15
N$3  (via drill 0.33)
  Top 0.203: v38.61,29.97 37.59,29.97 37.08,29.46 IC1.8 | v43.69,28.19 44.7,27.18 X.3
  Bottom 0.203: v38.61,29.97 41.91,29.97 v43.69,28.19
N$5
  Top 0.203: IC2.1 41.4,3.3 41.4,3.05 41.91,2.54 43.43,2.54 44.96,4.06 44.96,4.57 45.97,5.59 46.99,5.59 CHG.C
N$6
  Top 0.203: IC2.5 41.15,6.35 41.15,13.46 40.39,14.22 RC.2
N$8  (via drill 0.33)
  Top 0.203: v17.78,31.5 FB1.1
  Bottom 0.203: v17.78,31.5 17.02,32.26 5.59,32.26 TCPL.2
N$9
  Top 0.203: CTCP.1 10.16,23.11 9.91,23.37 9.91,32.51 11.68,34.29 13.72,34.29 14.48,33.53 14.48,33.02 IC6.2 14.73,32.77 14.73,32 16.26,30.48 20.83,30.48 FB1.2
N$10  (via drill 0.33)
  Top 0.203: v45.72,16.51 44.7,16.51 RN1.4 | v45.72,4.32 46.23,4.32 46.99,3.56 CHG.A
  Bottom 0.203: v45.72,4.32 v45.72,16.51
N$11  (via drill 0.33)
  Top 0.203: FB2.1 24.13,25.4 24.89,26.16 24.89,26.67 v22.86,28.7
  Bottom 0.203: v22.86,28.7 21.59,28.7 17.27,33.02 7.11,33.02 6.35,33.78 4.83,33.78 4.06,33.02 4.06,30.48 5.59,28.96 TCPL.1
N$12  (via drill 0.33)
  Top 0.203: v18.8,23.11 CTCP.2 | FB2.2 v25.15,23.62 | v13.46,31.24 13.46,32.77 IC6.3
  Bottom 0.203: 20.83,23.11 24.64,23.11 v25.15,23.62 | 20.83,23.11 v18.8,23.11 | v13.46,31.24 14.22,31.24 14.48,31.5 14.99,31.5 15.49,30.99 15.49,30.48 14.99,29.97 14.99,27.94 18.03,24.89 19.05,24.89 20.83,23.11
N$21
  Top 0.203: X2.2 50.55,21.08 50.55,25.91 49.53,26.92 48.77,26.92 RTC.1
N$30
  Top 0.203: X2.1 48.51,21.08 50.04,22.61 50.04,25.15 49.53,25.65 48.77,25.65 RTC.2
N$34  (via drill 0.33)
  Top 0.203: v25.91,56.39 25.91,54.36 REA1.1 | IC7.27 v40.39,49.02
  Bottom 0.203: v25.91,56.39 33.02,56.39 v40.39,49.02
N$37  (via drill 0.33)
  Top 0.203: v21.08,55.63 21.08,54.36 REB1.1 | v40.39,48.01 41.4,48.01 41.66,47.75 IC7.26
  Bottom 0.203: v21.08,55.63 32.77,55.63 v40.39,48.01
N$39  (via drill 0.33)
  Top 0.203: v30.73,49.28 29.97,48.51 29.21,48.51 CAP.1 | v30.73,50.8 31.75,50.8 32.26,50.29 IC7.1
  Bottom 0.203: v30.73,50.8 v30.73,49.28
N$41  (via drill 0.33)
  Top 0.203: CX3.1 45.97,33.02 46.48,32.51 46.48,32.26 46.74,32 48.51,32 48.51,36.32 46.23,38.61 46.23,42.67 47.24,43.69 X3.2 | v43.94,45.21 IC7.24
  Bottom 0.203: v43.94,45.21 45.97,45.21 47.24,43.94 X3.2
N$42  (via drill 0.33)
  Top 0.203: CX4.1 48.26,49.28 48.26,40.13 47.24,39.12 X3.1 | IC7.23 43.18,43.94 v43.43,44.2
  Bottom 0.203: v43.43,44.2 43.43,42.93 47.24,39.12 X3.1
N$54  (via drill 0.33)
  Top 0.203: RR-.1 26.16,35.31 26.16,36.58 23.62,39.12 23.62,39.62 RR+.2 23.37,39.62 v23.37,40.89 | v22.35,51.82 22.35,50.55 C13.2
  Bottom 0.203: v22.35,51.82 22.35,41.91 v23.37,40.89
N$59
  Top 0.203: RBS.2 28.19,27.94 28.19,29.72 32.26,33.78 IC7.14
P0  (via drill 0.33)
  Top 0.203: v61.47,45.47 61.47,35.05 60.96,34.54 54.61,34.54 Q2.1 | v3.3,41.15 3.3,28.7 6.1,25.91 6.6,25.91 7.11,25.4 7.11,21.59 v9.14,19.56 | v9.14,15.24 9.14,13.97 10.41,12.7 IC5.10
  Bottom 0.203: v61.47,45.47 61.47,46.48 50.8,57.15 17.02,57.15 7.11,47.24 7.11,44.96 v3.3,41.15 | v9.14,15.24 v9.14,19.56
P1  (via drill 0.33)
  Top 0.203: v43.69,47.24 43.69,53.34 Q1.1 | v35.31,42.67 v39.12,42.67 | v29.46,33.78 29.46,31.75 v27.43,29.72 | v24.13,26.42 23.11,25.4 v23.11,20.32 | v12.45,11.18 10.92,11.18 10.67,11.43 IC5.11
  Bottom 0.203: v39.12,42.67 v43.69,47.24 | v35.31,42.67 34.29,42.67 34.04,42.93 33.53,42.93 31.5,40.89 31.5,34.8 30.48,33.78 v29.46,33.78 | v24.13,26.42 v27.43,29.72 | v23.11,20.32 23.11,18.8 16.76,12.45 16.76,11.68 16.26,11.18 v12.45,11.18
P2  (via drill 0.33)
  Top 0.203: IC7.10 29.97,38.86 ETHRESET.1 | v16.76,10.16 IC5.12 | v24.89,16.51 v22.61,14.22 | v28.7,32.26 28.7,33.53 v28.45,33.78 | N5110.1 59.69,43.43 56.39,46.74 v49.53,46.74
  Bottom 0.203: 25.4,46.74 25.4,43.43 ETHRESET.1 27.94,42.93 30.99,39.88 30.99,34.8 30.48,34.29 29.97,34.29 29.72,34.54 29.21,34.54 v28.45,33.78 | 25.4,46.74 ETHRESETS.2 | v16.76,10.16 18.54,10.16 v22.61,14.22 | v24.89,16.51 33.78,25.4 33.78,26.16 28.7,31.24 v28.7,32.26 | v49.53,46.74 46.23,46.74 44.96,48.01 41.91,48.01 40.64,46.74 25.4,46.74
P3
  Top 0.203: RM4.1 33.02,54.61 | IC5.13 8.38,8.89 6.35,6.86 2.79,6.86 1.52,8.13 1.52,41.91 0.76,42.67 0.76,49.78 8.13,57.15 30.48,57.15 33.02,54.61 | 33.02,54.61 RM3.2
P4
  Top 0.203: IC5.14 9.65,7.62 5.84,3.81 4.32,3.81 SV1.2
P5
  Top 0.203: IC5.15 9.4,6.35 SV1.1
P6  (via drill 0.33)
  Top 0.203: v12.7,5.08 IC5.16 | v66.55,25.4 63.5,28.45 BTN.B 63.75,28.7 v64.77,29.72 | v64.77,34.29 63.75,35.31 BTN.B'
  Bottom 0.203: v12.7,5.08 17.27,0.51 59.69,0.51 66.55,7.37 v66.55,25.4 | v64.77,29.72 v64.77,34.29
P7  (via drill 0.33)
  Top 0.203: v62.48,32.26 62.48,25.15 64.26,23.37 65.02,23.37 66.04,22.35 66.04,19.05 65.28,18.29 64.01,18.29 61.98,16.26 57.4,16.26 55.37,14.22 50.8,14.22 49.78,13.21 Q3.1 | v0.76,38.61 0.76,3.81 2.79,1.78 7.87,1.78 9.91,3.81 IC5.17
  Bottom 0.203: v62.48,32.26 62.48,45.97 50.8,57.66 14.48,57.66 5.33,48.51 3.56,48.51 0.76,45.72 v0.76,38.61
RD+  (via drill 0.33)
  Top 0.203: v25.4,38.35 25.4,39.62 RR+.1 | v30.23,35.05 IC7.13
  Bottom 0.203: RJ45.RD+ 12.45,39.88 13.46,40.89 15.75,40.89 18.29,38.35 v25.4,38.35 28.7,35.05 v30.23,35.05
RD-  (via drill 0.33)
  Top 0.203: 28.19,35.31 29.46,35.31 30.48,36.32 IC7.12 | v25.91,34.04 26.92,34.04 28.19,35.31 | 28.19,35.31 RR-.2
  Bottom 0.203: RJ45.RD- 9.4,37.34 12.7,34.04 v25.91,34.04
RESET  (via drill 0.33)
  Top 0.203: ETHRESET.2 v21.59,41.15 | v41.91,19.05 39.37,21.59 IC1.29 | RRST.1 58.42,13.72 v58.42,12.45 60.2,10.67 65.02,10.67 68.58,14.22 68.58,54.61 65.53,57.66 44.96,57.66 38.86,51.56 v33.02,51.56
  Bottom 0.203: ETHRESET.2 23.88,43.43 ETHRESETS.1 24.38,48.51 24.38,48.77 27.18,51.56 v33.02,51.56 | ISP.5 14.73,42.93 16.51,41.15 v21.59,41.15 | v41.91,19.05 46.23,19.05 52.83,12.45 v58.42,12.45
RXD  (via drill 0.33)
  Top 0.203: v41.66,20.32 39.88,22.1 IC1.30
  Bottom 0.203: v41.66,20.32 47.5,20.32 51.56,16.26 51.56,15.24 52.07,14.73 54.36,14.73 58.42,18.8 62.74,18.8 JP1.3
SCK  (via drill 0.33)
  Top 0.203: v55.12,38.1 v57.15,38.1 | v35.81,38.35 32.77,41.4 IC7.8 v28.45,41.4 | D2.C 10.67,22.1 v9.14,20.57 8.64,20.57 7.62,21.59 7.62,30.73 9.65,32.77 9.65,37.59 10.92,38.86 10.92,43.43 11.94,44.45 ISP.3 | v27.94,23.11 30.73,23.11 IC1.17
  Bottom 0.203: v57.15,38.1 57.15,39.37 MICROSD.5 | v55.12,38.1 54.61,38.1 49.53,33.02 41.15,33.02 v35.81,38.35 | SV1.11 7.62,17.27 7.62,19.05 v9.14,20.57 9.65,21.08 23.62,21.08 25.65,23.11 v27.94,23.11 | v28.45,41.4 26.42,41.4 25.15,40.13 23.11,40.13 22.35,40.89 22.35,41.4 21.84,41.91 19.3,41.91 19.05,41.66 16.51,41.66 12.7,45.47 ISP.3
SCK1
  Top 0.203: D2.A 10.67,25.15 11.94,26.42 IC6.5 12.19,26.67 12.19,27.69 13.46,28.96 20.07,28.96 21.08,27.94 RTCP1.2
SCL  (via drill 0.33)
  Top 0.203: v17.27,2.54 IC5.1 | RN3.1 50.8,29.72 v50.8,27.94 54.1,24.64 54.86,24.64 RTC.6 55.12,24.64 v56.64,24.64 | IC1.28 38.61,20.83 39.12,20.83 v40.13,19.81 37.34,17.02 37.34,14.22 v36.07,12.95 | U$1.P$6 63.75,55.88 64.52,55.12 66.8,55.12 67.06,54.86 v67.06,37.59
  Bottom 0.203: SV1.10 4.32,11.94 5.84,11.94 7.11,10.67 9.14,10.67 v17.27,2.54 17.27,1.52 17.78,1.02 22.35,1.02 34.29,12.95 v36.07,12.95 | v40.13,19.81 40.13,20.57 47.5,27.94 v50.8,27.94 | v67.06,37.59 67.06,26.92 JP1.6 64.52,24.38 58.42,24.38 58.17,24.64 v56.64,24.64
SDA  (via drill 0.33)
  Top 0.203: v14.99,3.81 IC5.2 v22.35,3.81 | RTC.5 54.86,23.37 54.1,23.37 50.04,27.43 50.04,30.23 50.29,30.48 51.31,30.48 51.56,30.23 51.56,29.97 RN3.2 51.82,29.72 v51.82,28.45 | IC1.27 38.1,20.32 38.61,19.81 v39.12,19.81 36.07,16.76 v36.07,13.97 | v61.47,56.39 62.48,56.39 U$1.P$7
  Bottom 0.203: v14.99,3.81 9.4,9.4 4.32,9.4 SV1.8 | v39.12,19.81 39.62,20.32 39.62,20.57 47.75,28.7 51.56,28.7 v51.82,28.45 53.85,26.42 | 53.85,26.42 56.39,23.88 62.74,23.88 JP1.5 | v61.47,56.39 61.47,47.5 63.25,45.72 63.25,29.21 60.45,26.42 53.85,26.42 | v22.35,3.81 24.64,3.81 34.8,13.97 v36.07,13.97
TCT  (via drill 0.33)
  Top 0.203: 49.53,53.09 53.34,53.09 59.69,46.74 L1.1 | RT+.2 21.08,34.8 v22.35,34.8 25.4,31.75 RT-.1 | v47.5,53.09 49.53,53.09 | 49.53,53.09 C12.2
  Bottom 0.203: v22.35,34.8 14.48,34.8 11.94,37.34 RJ45.P4 10.92,37.34 10.92,46.99 10.67,47.24 10.67,49.02 14.22,52.58 33.02,52.58 38.35,47.24 40.64,47.24 46.48,53.09 v47.5,53.09
TD+  (via drill 0.33)
  Top 0.203: v18.03,36.83 20.83,36.83 | 20.83,36.83 21.08,36.83 RT+.1 20.83,36.83 | IC7.17 40.89,36.32 v40.39,36.83 | v27.18,43.69 26.16,44.7 23.11,44.7 21.08,42.67 21.08,41.66 20.83,41.4 20.83,36.83
  Bottom 0.203: v18.03,36.83 14.99,39.88 RJ45.TD+ | v40.39,36.83 40.39,38.61 35.31,43.69 v27.18,43.69
TD-  (via drill 0.33)
  Top 0.203: v27.18,33.27 27.18,31.75 RT-.2 | IC7.16 35.56,35.05 v33.53,33.02
  Bottom 0.203: RJ45.TD- 13.72,37.34 14.99,36.07 24.89,36.07 27.18,33.78 v27.18,33.27 27.43,33.02 v33.53,33.02
TXD  (via drill 0.33)
  Top 0.203: v42.93,22.1 40.89,22.1 40.39,22.61 IC1.31 | v53.09,22.1 58.42,16.76 61.98,16.76 JP1.4
  Bottom 0.203: v53.09,22.1 v42.93,22.1
V_ETH  (via drill 0.33)
  Top 0.203: v43.43,33.78 IC7.15 | 41.91,40.13 v43.43,38.61 | 41.91,40.13 41.91,38.86 IC7.19 | 41.91,40.13 IC7.20 | 41.91,51.56 41.91,50.29 IC7.28 | 41.91,51.56 41.91,53.34 44.2,55.63 44.7,55.63 Q1.3 | IC7.25 40.89,46.48 40.13,47.24 | 40.13,47.24 39.62,47.75 39.62,49.28 41.91,51.56 | 40.13,47.24 v38.35,45.47
  Bottom 0.203: v43.43,33.78 v43.43,38.61 42.16,38.61 38.35,42.42 v38.35,45.47
V_LCD
  Top 0.203: N5110.7 57.91,22.1 57.91,27.94 52.32,33.53 52.32,35.31 Q2.3
VBAT
  Top 0.203: J1.2 J1.5 64.26,2.03 62.99,2.03 61.98,1.02 56.64,1.02 49.78,7.87 | 49.78,7.87 52.83,7.87 53.09,8.13 CN1.1 | 49.78,7.87 47.5,7.87 43.18,3.56 IC2.3
VBUS  (via drill 0.33)
  Top 0.203: v43.94,11.43 43.94,16 43.43,16.51 RN1.5 | v43.94,7.11 43.18,6.35 IC2.4 | v24.38,19.56 25.65,20.83 26.16,20.83 C1.1 | v25.91,10.16 26.67,9.4 X1.VBUS | v31.75,53.34 38.1,53.34 38.35,53.59 38.35,53.85 39.12,54.61 RM4.2
  Bottom 0.203: v43.94,7.11 v43.94,11.43 40.64,14.73 35.05,14.73 31.24,10.92 26.92,10.92 25.91,11.94 | 25.91,11.94 23.11,14.73 23.11,18.29 v24.38,19.56 25.4,19.56 30.23,24.38 30.23,27.94 24.64,33.53 10.67,33.53 7.37,36.83 7.37,38.35 8.64,39.62 8.64,40.64 10.41,42.42 10.41,46.99 ISP.2 9.4,48.26 14.48,53.34 v31.75,53.34 | 25.91,11.94 v25.91,10.16
VCC  (via drill 0.33)
  Top 0.203: 60.96,50.04 57.4,53.59 C6.1 | 60.96,50.04 61.47,49.53 61.47,46.74 L1.2 61.72,46.74 61.72,46.23 62.23,45.72 62.23,35.31 60.96,34.04 55.88,34.04 55.37,33.53 53.59,33.53 53.34,33.78 53.34,36.07 | 65.02,53.59 U$1.P$3 65.02,51.82 64.26,51.05 61.98,51.05 60.96,50.04 | 65.02,53.59 65.79,54.36 U$1.P$4 | Q1.2 45.72,53.59 46.23,53.59 49.02,56.39 59.94,56.39 61.98,54.36 U$1.P$8 62.23,54.36 62.99,53.59 65.02,53.59 | 54.36,40.89 54.36,45.21 RSD.2 | 54.36,40.89 54.36,36.32 Q2.2 54.36,36.07 53.34,36.07 | 54.36,40.89 v58.17,40.89 | 36.32,26.67 37.85,28.19 IC1.6 38.1,28.45 40.13,30.48 44.7,30.48 | 36.32,26.67 33.53,23.88 32.51,23.88 31.5,22.86 IC1.18 | 36.32,26.67 38.35,26.67 38.61,26.92 39.12,26.92 IC1.4 | 51.05,31.24 51.56,31.24 RN3.7 51.56,30.99 52.07,30.48 53.85,30.48 54.86,29.46 54.86,27.18 RTC.8 55.12,26.92 55.63,26.92 57.4,25.15 57.4,23.88 56.13,22.61 53.59,22.61 53.34,22.86 52.83,22.86 49.02,19.05 49.02,14.22 48.77,13.97 48.77,12.19 49.02,11.94 50.29,11.94 51.31,12.95 Q3.2 51.56,13.21 56.13,13.21 56.64,13.72 RRST.2 56.9,13.72 56.9,14.48 57.66,15.24 64.01,15.24 JP1.2 | 51.05,31.24 50.8,31.24 RN3.8 | 47.24,30.99 45.21,30.99 44.7,30.48 | 47.24,30.99 50.55,30.99 RN3.8 | 44.7,30.48 43.69,29.46 C4.2 | 47.24,30.99 47.24,25.4 48.01,24.64 48.51,24.64 RTC.3 | 53.34,36.07 51.31,36.07 51.05,35.81 51.05,31.24 | 51.05,31.24 RN3.8 | CEXP1.1 16.26,15.75 16.26,17.02 18.29,19.05 DHT22.1 18.29,19.3 20.32,21.34 | RTCP2.1 20.07,21.59 20.32,21.34 | 21.08,20.57 21.84,19.81 RH.1 21.84,19.56 23.11,19.56 24.38,18.29 29.72,18.29 RU.2 | 21.08,20.57 20.32,21.34 | 21.08,20.57 21.08,25.15 19.56,26.67 19.56,27.94 RTCP1.1
  Top 0.203: 12.19,33.02 IC6.4 11.94,32.77 v11.94,29.97 | v5.84,19.56 CTC1.1 | SV1.12 2.03,16.76 2.03,23.62 3.05,24.64 CTC2.1 | IC4.2 43.94,8.89 47.75,8.89 C11.1 47.75,9.14 v52.07,9.14 | 33.78,2.03 32.26,0.51 12.7,0.51 11.68,1.52 | 33.78,2.03 35.31,3.56 37.59,3.56 C3.1 | 11.68,1.52 10.67,2.54 IC5.18 | 19.05,8.89 IC5.6 19.81,8.89 | 11.68,1.52 19.05,8.89 | v45.72,3.3 44.7,3.3 43.43,2.03 33.78,2.03 | 19.05,8.89 v16,11.94
  Bottom 0.203: v58.17,40.89 58.17,39.62 MICROSD.4 | 3.81,16 4.32,16.51 4.32,18.03 v5.84,19.56 5.84,23.88 v11.94,29.97 | 14.22,16 12.7,14.48 5.33,14.48 3.81,16 | 14.22,16 17.27,19.05 18.29,19.05 DHT22.1 | 3.81,16 SV1.12 | JP1.2 65.79,13.46 65.79,11.43 63.5,9.14 v52.07,9.14 51.56,9.14 v45.72,3.3 | 14.22,16 16,14.22 v16,11.94
VDD  (via drill 0.33)
  Top 0.203: 61.72,2.54 61.72,7.87 J1.1 | 61.72,2.54 61.72,2.29 J1.4 61.72,2.54 | v41.91,10.92 42.93,10.92 IC4.3 | v39.62,10.92 37.34,8.64 C2.1 | v58.93,2.54 61.72,2.54
  Bottom 0.203: v39.62,10.92 v41.91,10.92 41.91,6.1 45.47,2.54 v58.93,2.54

### Text on the board
tPlace: RESET | GND | D3 | T+ | D4 | D5 | VCON | SCL | SDA | VCON | TXD | GND | RXD | VCC | 1+ | 1- | GND | 2+ | 2- | 3+ | 3- | 4+ | 4-
bPlace: MISO | GND | Open-Lab-Monitor | VUSB-REVA | VUSB-REVB
tNames: T-